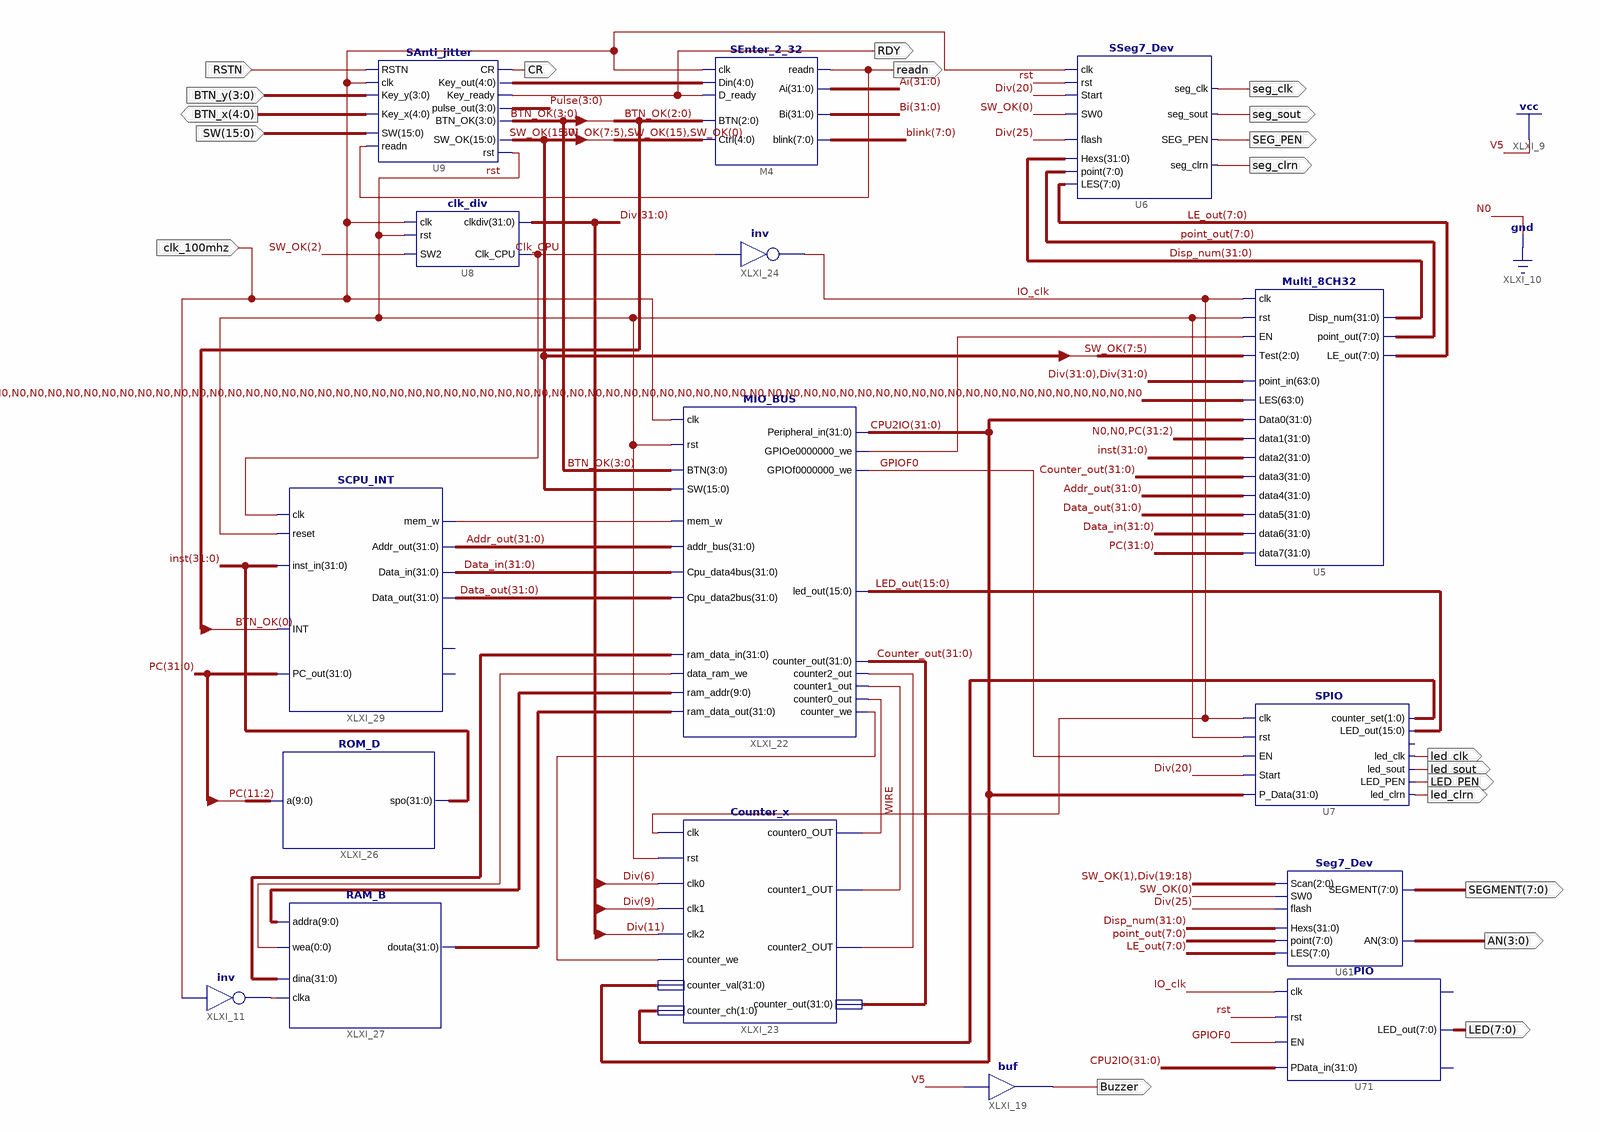
[diagram p0: schematic sheet 1]
// Xilinx ISE schematic Top_OExp08.sch (kintex7) as structural Verilog: 16 symbols, 20 ports
module Top_OExp08 (
  input  RSTN,
  input  [3:0] BTN_y,
  input  [15:0] SW,
  input  clk_100mhz,
  output [4:0] BTN_x,
  output CR,
  output readn,
  output RDY,
  output seg_clk,
  output seg_sout,
  output SEG_PEN,
  output seg_clrn,
  output led_clk,
  output led_sout,
  output LED_PEN,
  output led_clrn,
  output [7:0] SEGMENT,
  output [3:0] AN,
  output Buzzer,
  output [7:0] LED
);

  wire Clk_CPU, EN, GPIOF0, IO_clk, rst, WIRE, XLXN_69, XLXN_118, XLXN_149, XLXN_152, XLXN_153;
  wire [0:0] XLXN_110;
  wire [1:0] XLXN_161;
  wire [3:0] BTN_OK, Pulse;
  wire [4:0] XLXN_9;
  wire [7:0] blink, LE_out, point_out;
  wire [9:0] XLXN_105;
  wire [15:0] LED_out, SW_OK;
  wire [31:0] Addr_out, Ai, Bi, Counter_out, CPU2IO, Data_in, Data_out, Disp_num, Div, inst, PC, XLXN_99,
       XLXN_115;

  SAnti_jitter U9 (
    .SW(SW), .readn(readn), .Key_y(BTN_y), .Key_x(BTN_x), .RSTN(RSTN), .clk(clk_100mhz), .Key_out(XLXN_9),
    .Key_ready(RDY), .CR(CR), .rst(rst), .SW_OK(SW_OK), .pulse_out(Pulse), .BTN_OK(BTN_OK));
  clk_div U8 (.rst(rst), .clk(clk_100mhz), .SW2(SW_OK[2]), .clkdiv(Div), .Clk_CPU(Clk_CPU));
  SEnter_2_32 M4 (
    .readn(readn), .Ai(Ai), .Bi(Bi), .blink(blink), .Din(XLXN_9), .D_ready(RDY), .clk(clk_100mhz),
    .Ctrl({SW_OK[7:5], SW_OK[15], SW_OK[0]}), .BTN(BTN_OK[2:0]));
  SSeg7_Dev U6 (
    .LES(LE_out), .SEG_PEN(SEG_PEN), .seg_sout(seg_sout), .seg_clrn(seg_clrn), .point(point_out),
    .Hexs(Disp_num), .SW0(SW_OK[0]), .flash(Div[25]), .seg_clk(seg_clk), .clk(clk_100mhz), .rst(rst),
    .Start(Div[20]));
  Multi_8CH32 U5 (
    .Test(SW_OK[7:5]), .point_in({Div, Div}), .EN(EN), .clk(IO_clk), .rst(rst), .LES({64{1'b0}}),
    .Data0(CPU2IO), .data1({2'b00, PC[31:2]}), .data2(inst), .data3(Counter_out), .data4(Addr_out),
    .data5(Data_out), .data6(Data_in), .data7(PC), .point_out(point_out), .LE_out(LE_out), .Disp_num(Disp_num));
  SPIO U7 (
    .clk(IO_clk), .P_Data(CPU2IO), .rst(rst), .EN(GPIOF0), .Start(Div[20]), .led_clk(led_clk),
    .LED_out(LED_out), .counter_set(XLXN_161), .led_clrn(led_clrn), .LED_PEN(LED_PEN), .led_sout(led_sout));  // open: GPIOf0
  not XLXI_11 (XLXN_69, clk_100mhz);
  PIO U71 (.clk(IO_clk), .rst(rst), .EN(GPIOF0), .PData_in(CPU2IO), .LED_out(LED));  // open: GPIOf0, counter_set
  buf XLXI_19 (Buzzer, 1'b1);
  Seg7_Dev U61 (
    .LES(LE_out), .Scan({SW_OK[1], Div[19:18]}), .SEGMENT(SEGMENT), .AN(AN), .point(point_out),
    .flash(Div[25]), .SW0(SW_OK[0]), .Hexs(Disp_num));
  MIO_BUS XLXI_22 (
    .rst(rst), .clk(clk_100mhz), .mem_w(XLXN_118), .addr_bus(Addr_out), .Cpu_data4bus(Data_in),
    .Cpu_data2bus(Data_out), .ram_data_out(XLXN_99), .ram_addr(XLXN_105), .data_ram_we(XLXN_110[0]),
    .ram_data_in(XLXN_115), .counter_out(Counter_out), .counter2_out(XLXN_153), .counter1_out(XLXN_152),
    .counter0_out(WIRE), .counter_we(XLXN_149), .BTN(BTN_OK), .SW(SW_OK), .led_out(LED_out),
    .Peripheral_in(CPU2IO), .GPIOe0000000_we(EN), .GPIOf0000000_we(GPIOF0));
  Counter_x XLXI_23 (
    .clk(IO_clk), .rst(rst), .clk0(Div[6]), .clk1(Div[9]), .clk2(Div[11]), .counter_we(XLXN_149),
    .counter_val(CPU2IO), .counter_ch(XLXN_161), .counter0_OUT(WIRE), .counter1_OUT(XLXN_152),
    .counter2_OUT(XLXN_153), .counter_out(Counter_out));
  not XLXI_24 (IO_clk, Clk_CPU);
  ROM_D XLXI_26 (.a(PC[11:2]), .spo(inst));
  RAM_B XLXI_27 (.addra(XLXN_105), .clka(XLXN_69), .wea(XLXN_110[0]), .dina(XLXN_115), .douta(XLXN_99));
  SCPU_INT XLXI_29 (
    .clk(Clk_CPU), .reset(rst), .inst_in(inst), .INT(BTN_OK[0]), .Addr_out(Addr_out), .mem_w(XLXN_118),
    .Data_out(Data_out), .Data_in(Data_in), .PC_out(PC));  // open: CPU_MIO, MIO_ready
endmodule
